# Altium schematic sheet FoxSense_Power.SchDoc
size A4; SheetNumber: 2; SheetTotal: 2
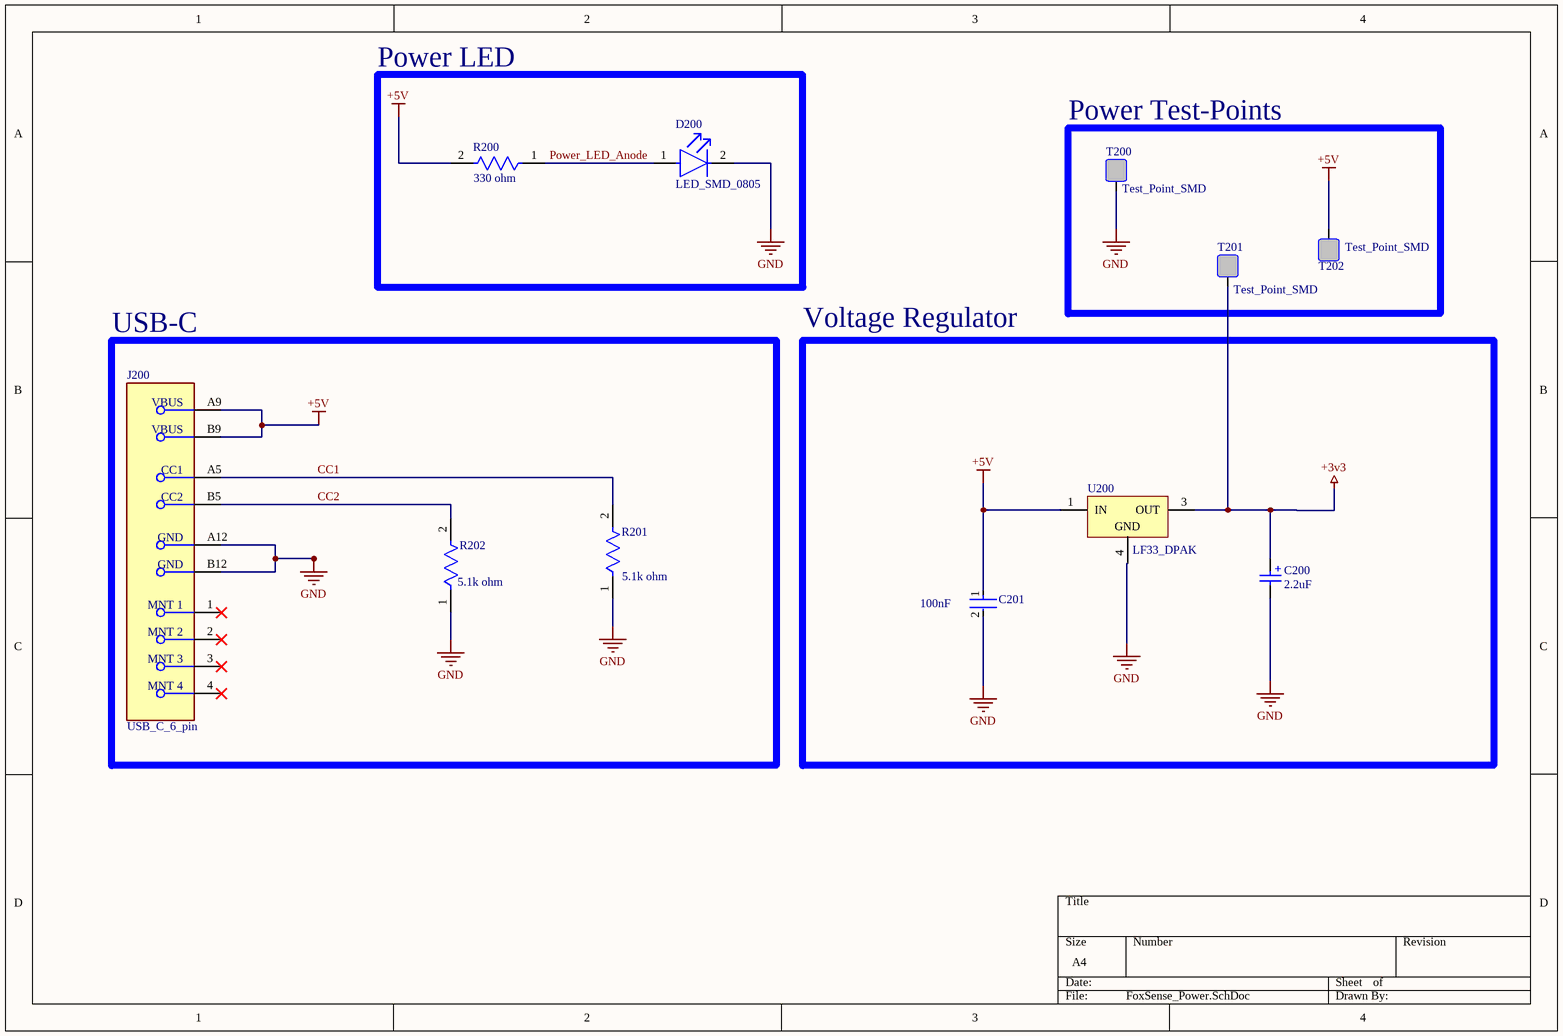
[diagram p0: FoxSense_Power.SchDoc]

## Parts
C200  2.2uF  [Capacitor_SMD_Electrolyte_2.2uF]
C201  100nF  [Capacitor_SMD_0805]
D200  LED_SMD_0805  [LED_SMD_0805]
J200  USB_C_6_pin  [USB_C_6_pin]
R200  330 ohm  [Resistor_SMD_0805]
R201  5.1k ohm  [Resistor_SMD_0805]
R202  5.1k ohm  [Resistor_SMD_0805]
T200  Test_Point_SMD  [TEST_Point_SMD]
T201  Test_Point_SMD  [TEST_Point_SMD]
T202  Test_Point_SMD  [TEST_Point_SMD]
U200  LF33_DPAK  [LF33]

## Blocks framed on the sheet
Power LED: D200 R200
Power Test-Points: T200-T202
USB-C: J200 R201 R202
Voltage Regulator: C200 C201 U200

## Nets
+3v3: C200.1(P) T201.1 U200.3(OUT)
+5V: C201.1 J200.A9(VBUS) J200.B9(VBUS) R200.2 T202.1 U200.1(IN)
GND: C200.2(N) C201.2 D200.2(C) J200.A12(GND) J200.B12(GND) R201.1 R202.1 T200.1 U200.4(GND)
CC1: J200.A5(CC1) R201.2
CC2: J200.B5(CC2) R202.2
Power_LED_Anode: D200.1(A) R200.1

Not connected (* = marked no-connect by the designer): J200 1(MNT_1)* 2(MNT_2)* 3(MNT_3)* 4(MNT_4)*

## Notes on the sheet
- (in symbol Capacitor_SMD_Electrolyte_2.2uF) +

## Library data of the parts
C200 = Capacitor_SMD_Electrolyte_2.2uF: Capacitor SMD Electrolyte 2.2uF
C201 = Capacitor_SMD_0805: capacitor smd 0805
D200 = LED_SMD_0805: LED SMD 0805
J200 = USB_C: USB C connector 6 pin
R200-R202 = Resistor_SMD_0805: Resistor SMD 0805
T200-T202 = Test_Point_SMD: Test Point SMD
U200 = LF33: LF33 DPAK 3.3 voltage regulator